# EAGLE design SparkFun_FreeSoC2_load (EAGLE 7.7.0)
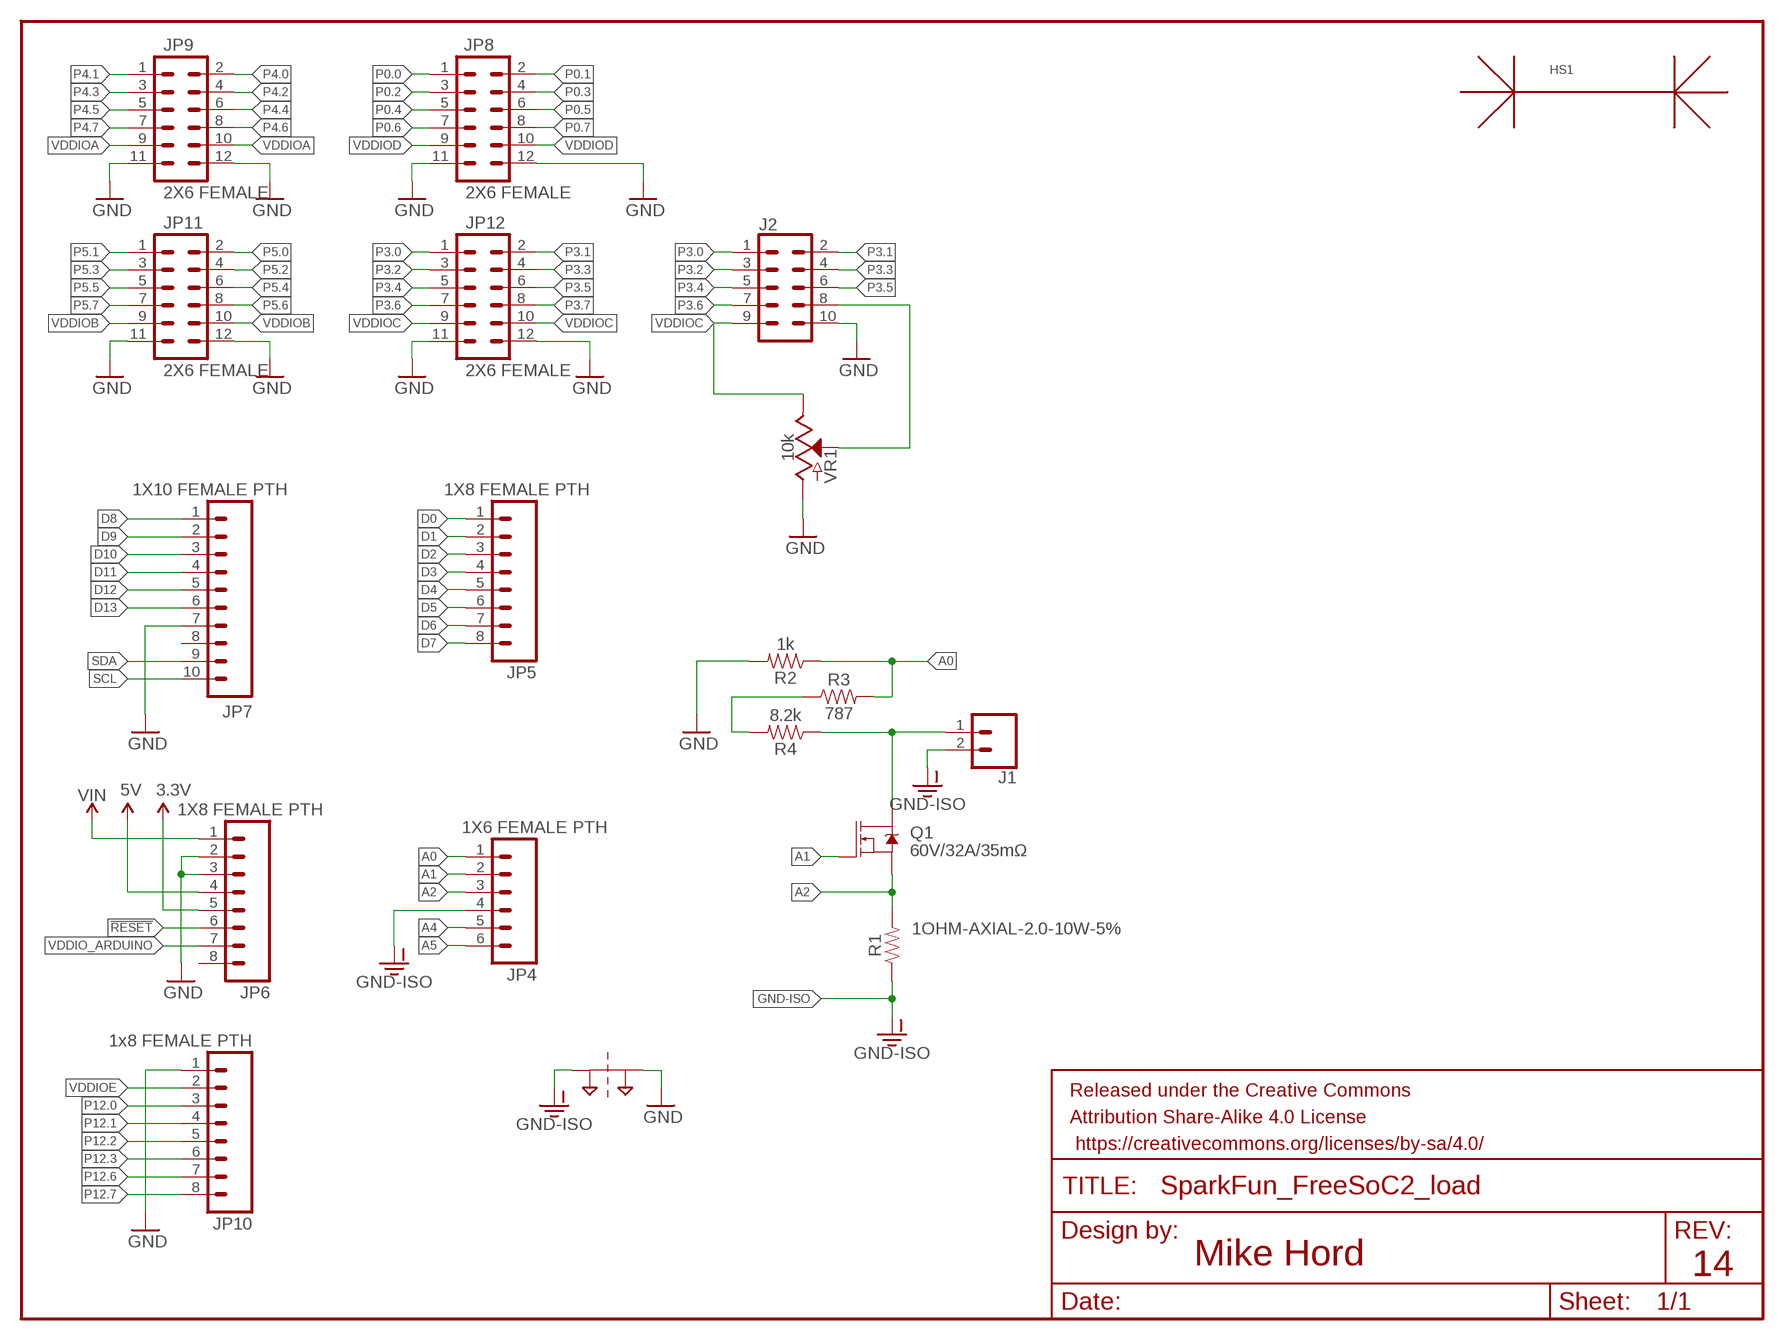
[diagram p0: schematic, sheet 1]

## Parts
FRAME3  FRAME-LETTERNO_PACKAGE  [DUMMY]
HS1  HEATSINKPRT-9576  [HEATSINK_PRT-9576]
J1  CONN_023.5MM  [SCREWTERMINAL-3.5MM-2]
J2  CONN_05X2SHD  [2X5-SHROUDED]
JP4  1X6 FEMALE PTH  M06SIP_LOCK  [1X06-SIP_LOCK]
JP5  1X8 FEMALE PTH  M08LOCK  [1X08_LOCK]
JP6  1X8 FEMALE PTH  M08LOCK  [1X08_LOCK]
JP7  1X10 FEMALE PTH  M10LOCK  [1X10_LOCK]
JP8  2X6 FEMALE  M06X2PTH_FEMALE  [2X6]
JP9  2X6 FEMALE  M06X2PTH_FEMALE  [2X6]
JP10  1x8 FEMALE PTH  M08LOCK  [1X08_LOCK]
JP11  2X6 FEMALE  M06X2PTH_FEMALE  [2X6]
JP12  2X6 FEMALE  M06X2PTH_FEMALE  [2X6]
Q1  60V/32A/35mΩ  MOSFET-NCH-FQP30N06L  [TO220V]
R1  1OHM-AXIAL-2.0-10W-5%  [AXIAL-2.0]
R2  1k  1KOHM-0603-1/10W-1%  [0603]
R3  787  787OHM-0603-1/10W-1%  [0603]
R4  8.2k  8.2KOHM-0603-1/10W-5%  [0603]
SUPPLY2  2PT_GND_TIE  [2PT_GND_TIE]
VR1  10k  POTENTIOMETER-PTH-9MM-1/20W-20%  [POT-PTH-ALPS]

## Nets
3.3V: JP6.5
5V: JP6.4
!RESET: JP6.6
A0: JP4.1 R2.1 R3.2
A1: JP4.2 Q1.1(G)
A2: JP4.3 Q1.3(S) R1.P$2
A4: JP4.5
A5: JP4.6
D0: JP5.1
D1: JP5.2
D2: JP5.3
D3: JP5.4
D4: JP5.5
D5: JP5.6
D6: JP5.7
D7: JP5.8
D8: JP7.1
D9: JP7.2
D10: JP7.3
D11: JP7.4
D12: JP7.5
D13: JP7.6
GND: J2.10 JP6.2 JP6.3 JP7.7 JP8.11 JP8.12 JP9.11 JP9.12 JP10.1 JP11.11 JP11.12 JP12.11 JP12.12 R2.2 SUPPLY2.P$1 VR1.P$3(A)
GND-ISO: J1.2 JP4.4 R1.P$1 SUPPLY2.P$2
N$3: J1.1 Q1.2(D) R4.1
N$4: R3.1 R4.2
N$15: J2.8 VR1.P$2(S)
P0.0: JP8.1
P0.1: JP8.2
P0.2: JP8.3
P0.3: JP8.4
P0.4: JP8.5
P0.5: JP8.6
P0.6: JP8.7
P0.7: JP8.8
P3.0: J2.1 JP12.1
P3.1: J2.2 JP12.2
P3.2: J2.3 JP12.3
P3.3: J2.4 JP12.4
P3.4: J2.5 JP12.5
P3.5: J2.6 JP12.6
P3.6: J2.7 JP12.7
P3.7: JP12.8
P4.0: JP9.2
P4.1: JP9.1
P4.2: JP9.4
P4.3: JP9.3
P4.4: JP9.6
P4.5: JP9.5
P4.6: JP9.8
P4.7: JP9.7
P5.0: JP11.2
P5.1: JP11.1
P5.2: JP11.4
P5.3: JP11.3
P5.4: JP11.6
P5.5: JP11.5
P5.6: JP11.8
P5.7: JP11.7
P12.0: JP10.3
P12.1: JP10.4
P12.2: JP10.5
P12.3: JP10.6
P12.6: JP10.7
P12.7: JP10.8
SCL: JP7.10
SDA: JP7.9
VDDIO_ARDUINO [ARDUINO_VCC]: JP6.7
VDDIOA: JP9.9 JP9.10
VDDIOB: JP11.9 JP11.10
VDDIOC: J2.9 JP12.9 JP12.10 VR1.P$1(E)
VDDIOD: JP8.9 JP8.10
VDDIOE: JP10.2
VIN: JP6.1
Unconnected: JP6.8 JP7.8

## Notes on the sheet
- Mike Hord
- 14

## Library data of the parts
FRAME3 = SparkFun-Aesthetics:FRAME-LETTER: Schematic Frame Standard 8.5x11 US Letter frame; DESIGNER: Nobody; VERSION: v01
HS1 = SparkFun-Electromechanical:HEATSINK; PROD_ID: COMP-9537
J1 = SparkFun-Connectors:CONN_02: Multi connection point. Often used as Generic Header-pin footprint for 0.1 inch spaced/style header connections On any of the 0.1 inch spaced packages, you can populate with these: Break Away Headers - Straight <https://www.sparkfun.com/products/116> (PRT-00116) Break Away Male Headers - Right Angle <https://www.sparkfun.com/products/553> (PRT-00553) Female Headers <https://www.sparkfun.com/products/115> (PRT-00115) Break Away Headers - Machine Pin <https://www.sparkfun.com/products/117> (PRT-00117) Break Away Female Headers - Swiss Machine Pin <https://www.sparkfun.com/products/743> (PRT-00743) For SCREWTERMINALS and SPRING TERMINALS visit here: Screw Terimnals on SparkFun.com <https://www.sparkfun.com/search/results?term=Screw+Terminals> (5mm/3.5mm/2.54mm spacing) This device is also useful as a general connection point to wire up your design to another part of your project. Our various solder wires solder well into these plated through hole pads. Hook-Up Wire - Assortment (Stranded, 22 AWG) <https://www.sparkfun.com/products/11375> (PRT-11375) Hook-Up Wire - Assortment (Solid Core, 22 AWG) <https://www.sparkfun.com/products/11367> (PRT-11367) View the entire wire category on our website here <https://www.sparkfun.com/categories/141> Special notes: Molex polarized connector foot print use with: PRT-08233 with associated crimp pins and housings. 2.54_SCREWTERM for use with PRT-10571. 3.5mm Screw Terminal footprints for PRT-08084 5mm Screw Terminal footprints for use with PRT-08432; PROD_ID: CONN-08399
J2 = SparkFun-Connectors:CONN_05X2: Multi connection point. Often used as Generic Header-pin footprint for 0.1 inch spaced/style header connections For AVR SPI programming port, see special device with nice symbol: "AVR_SPI_PROG_5x2.dev" You can populate with any combo of single row headers, but if you'd like an exact match, check these: 2x5 AVR ICSP Male Header <https://www.sparkfun.com/products/778> (PRT-00778) 2x5 Pin Shrouded Header <https://www.sparkfun.com/products/8506> (PRT-08506) On any of the 0.1 inch spaced packages, you can populate with these: Break Away Headers - Straight <https://www.sparkfun.com/products/116> (PRT-00116) Break Away Male Headers - Right Angle <https://www.sparkfun.com/products/553> (PRT-00553) Female Headers <https://www.sparkfun.com/products/115> (PRT-00115) Break Away Headers - Machine Pin <https://www.sparkfun.com/products/117> (PRT-00117) Break Away Female Headers - Swiss Machine Pin <https://www.sparkfun.com/products/743> (PRT-00743) Special note: the shrouded connector mates well with our 5x2 ribbon cables: 2x5 Pin IDC Ribbon Cable <https://www.sparkfun.com/products/8535> (PRT-08535); PROD_ID: CONN-08671; SF_ID: PRT-08506
JP4 = SparkFun-Connectors:M06: Header 6 Standard 6-pin 0.1" header. Use with straight break away headers (SKU : PRT-00116), right angle break away headers (PRT-00553), swiss pins (PRT-00743), machine pins (PRT-00117), and female headers (PRT-00115). Molex polarized connector foot print use with SKU : PRT-08094 with associated crimp pins and housings. NOTES ON THE VARIANTS LOCK and LOCK_LONGPADS... This footprint was designed to help hold the alignment of a through-hole component (i.e. 6-pin header) while soldering it into place. You may notice that each hole has been shifted either up or down by 0.005 of an inch from it's more standard position (which is a perfectly straight line). This slight alteration caused the pins (the squares in the middle) to touch the edges of the holes. Because they are alternating, it causes a "brace" to hold the component in place. 0.005 has proven to be the perfect amount of "off-center" position when using our standard breakaway headers. Although looks a little odd when you look at the bare footprint, once you have a header in there, the alteration is very hard to notice. Also,if you push a header all the way into place, it is covered up entirely on the bottom side. This idea of altering the position of holes to aid alignment will be further integrated into the Sparkfun Library for other footprints. It can help hold any component with 3 or more connection pins.; PROD_ID: CONN-08437
JP5 JP6 JP10 = SparkFun-Connectors:M08: Header 8 Standard 8-pin 0.1" header. Use with straight break away headers (SKU : PRT-00116), right angle break away headers (PRT-00553), swiss pins (PRT-00743), machine pins (PRT-00117), and female headers (PRT-00115).; PROD_ID: CONN-08438
JP7 = SparkFun-Connectors:M10: Header 10 Standard 10-pin 0.1" header. Use with straight break away headers (SKU : PRT-00116), right angle break away headers (PRT-00553), swiss pins (PRT-00743), machine pins (PRT-00117), and female headers (PRT-00115).; PROD_ID: CONN-11563
JP8 JP9 JP11 JP12 = SparkFun-Connectors:M06X2; PROD_ID: CONN-12423
Q1 = SparkFun-DiscreteSemi:MOSFET-NCH: N-channel MOSFETs Voltage controlled devices that allow control of high current outputs. SparkFun Products: SparkFun OpenScale <https://www.sparkfun.com/products/13261> SparkFun Digital Sandbox <https://www.sparkfun.com/products/12651> SparkFun Monster Moto Shield <https://www.sparkfun.com/products/10182> SparkFun MOSFET Power Controller <https://www.sparkfun.com/products/11214>; PROD_ID: TRANS-10060
R1 = SparkFun-Resistors:1OHM: 1Ω resistor A resistor is a passive two-terminal electrical component that implements electrical resistance as a circuit element. Resistors act to reduce current flow, and, at the same time, act to lower voltage levels within circuits. - Wikipedia
R2 = SparkFun-Resistors:1KOHM: 1kΩ resistor A resistor is a passive two-terminal electrical component that implements electrical resistance as a circuit element. Resistors act to reduce current flow, and, at the same time, act to lower voltage levels within circuits. - Wikipedia; PROD_ID: RES-07856
R3 = SparkFun-Resistors:787OHM: 787Ω resistor A resistor is a passive two-terminal electrical component that implements electrical resistance as a circuit element. Resistors act to reduce current flow, and, at the same time, act to lower voltage levels within circuits. - Wikipedia; PROD_ID: RES-11228
R4 = SparkFun-Resistors:8.2KOHM: 8.2kΩ resistor A resistor is a passive two-terminal electrical component that implements electrical resistance as a circuit element. Resistors act to reduce current flow, and, at the same time, act to lower voltage levels within circuits. - Wikipedia; PROD_ID: RES-10646
SUPPLY2 = SparkFun-PowerSymbols:2PT_GND_TIE: Dual Ground Supply Power supply symbol for connecting two grounds. SparkFun Products: SparkFun AutoDriver - Stepper Motor Driver <https://www.sparkfun.com/products/11611>
VR1 = SparkFun-Resistors:POTENTIOMETER: Potentiometer (Pot) Three-terminal potentiometers, with an adjustable wiper and two adjustable resistors. A pot can be used to create a configurable voltage divider, or as a variable resistor. Variants ALPS_POT and ALPS_POT_KIT - PTH, breadboard compatible, 9mm square pots Rotary Potentiometer - Linear (10k ohm) <https://www.sparkfun.com/products/9288> (COM-09288) The KIT variant exposes copper on only one side of the PTH pad, so the part can only be assembled on one side of the PCB. Useful for beginner soldering kits.; PROD_ID: RES-09177; SF_SKU: COM-09288

## Net classes
0 signal: width 0.178 mm, drill 0.381 mm, clearance 0.178 mm
1 AVCC: width 0.508 mm, drill 0.508 mm, clearance 0.178 mm
2 ARDUINO_VCC: width 0.508 mm, drill 0.381 mm

## Board
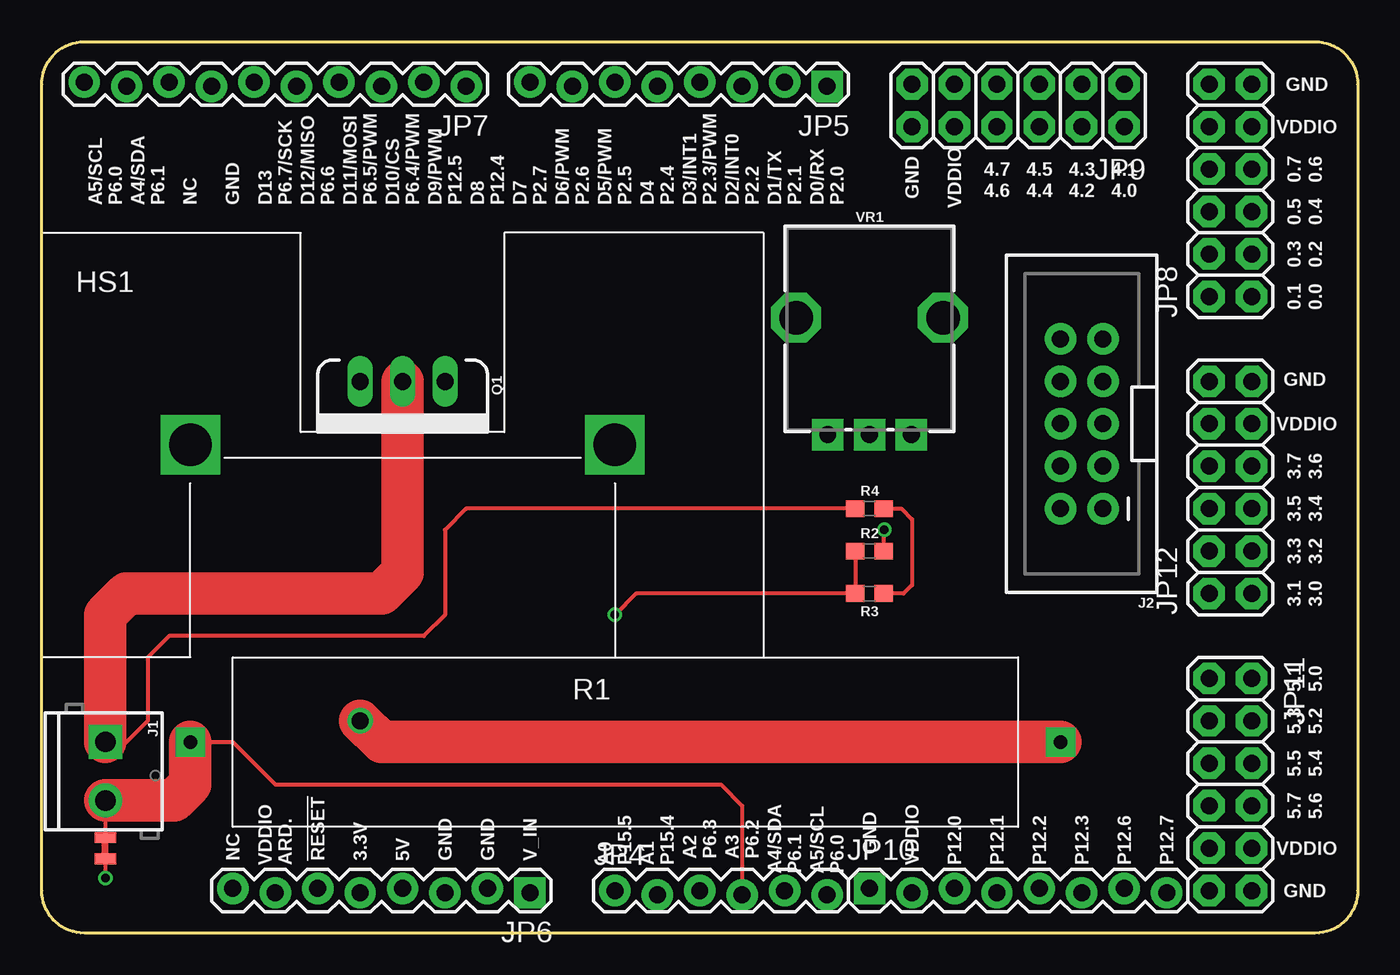
[diagram p1: board, top side]
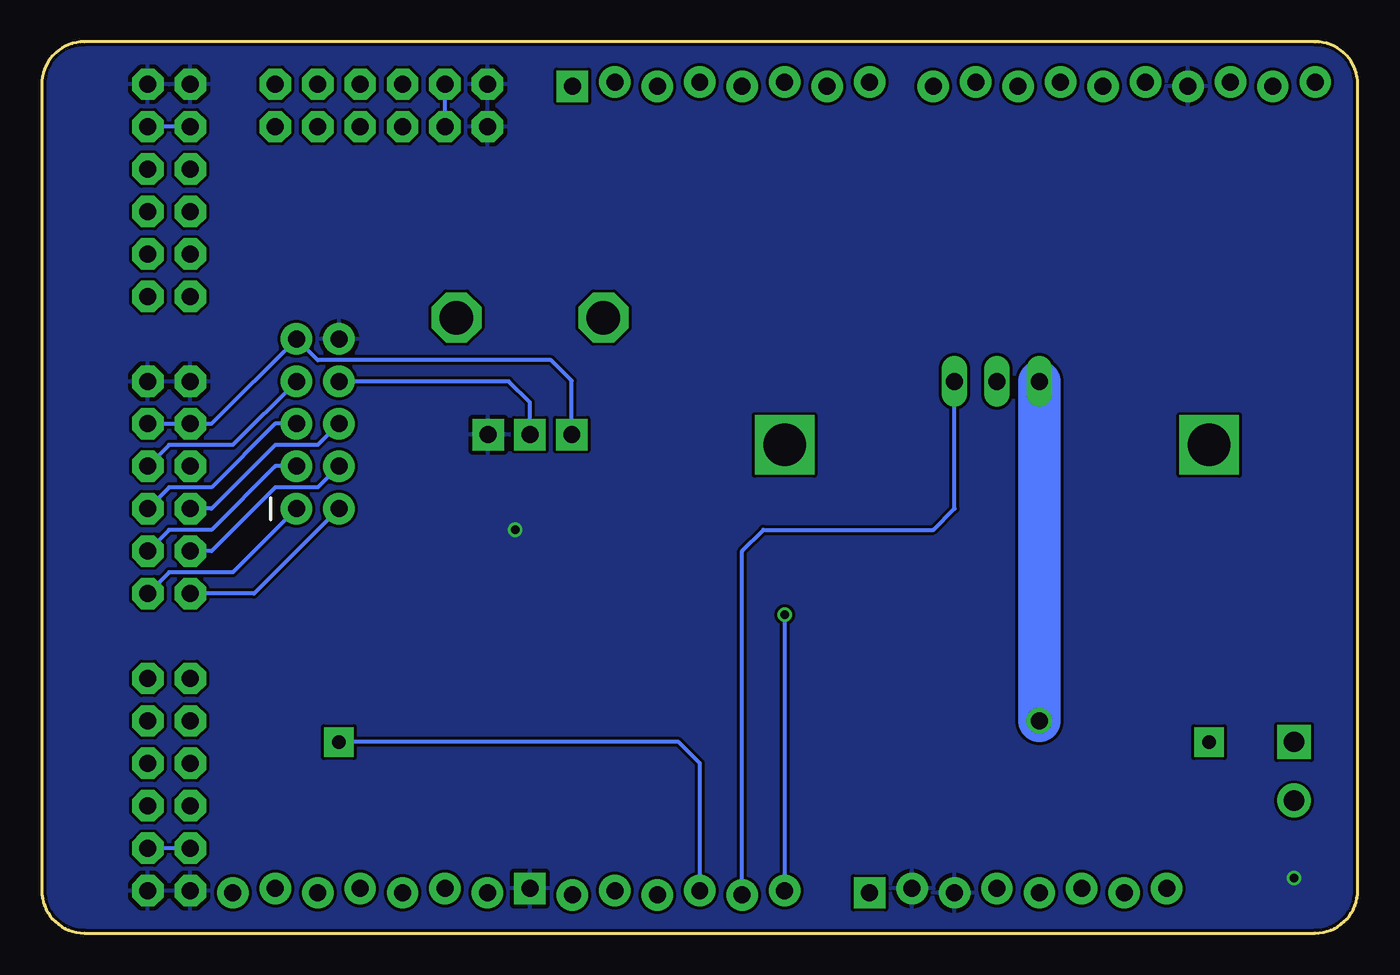
[diagram p2: board, bottom side, seen from below]

Size 78.74 x 53.34 mm. Coordinates in mm from the lower left corner, seen from the top.
Outline: 76.2,0 2.54,0 arc-90 0,2.54 0,50.8 arc-90 2.54,53.34 76.2,53.34 arc-90 78.74,50.8 78.74,2.54 arc-90 76.2,0
Copper layers (1*2*15*16): Top 0.035mm / dielectric 1.5mm / Route2 0.035mm / dielectric 0.15mm / Route15 0.035mm / dielectric 0.2mm / Bottom 0.035mm
Design rules "SparkFun-2-layer-TIGHT *": minimum track width 7mil, minimum drill 15mil, track to track 7mil, track to pad 7mil, pad to pad 7mil, via to via 7mil, smd to smd 7mil, copper to edge 7mil, drill to drill 7mil, minimum pad ring 7mil, minimum via ring 7mil, stop-mask expansion 4mil, vias tented up to drill 20mil, thermal gap 10mil

### Footprints (pad centres in the part's own frame; a part is rotated, then mirrored left to right if it is on the bottom)
HEATSINK_PRT-9576 = drill 2.54 square: P$1 -12.7,0; P$2 12.7,0
SCREWTERMINAL-3.5MM-2 = drill 1.2 pad 2.032 square: 1 0,0 | drill 1.2 pad 2.032: 2 3.5,0
2X5-SHROUDED = drill 1.016 pad 1.88: 1 -1.27,5.08; 2 1.27,5.08; 3 -1.27,2.54; 4 1.27,2.54; 5 -1.27,0; 6 1.27,0; 7 -1.27,-2.54; 8 1.27,-2.54; 9 -1.27,-5.08; 10 1.27,-5.08
1X06-SIP_LOCK = drill 1.016 pad 1.88: 1 0,0; 2 2.54,-0.254; 3 5.08,0; 4 7.62,-0.254; 5 10.16,0; 6 12.7,-0.254
1X08_LOCK = drill 1.016 pad 1.88 square: 1 0,0.127 | drill 1.016 pad 1.88: 2 2.54,-0.127; 3 5.08,0.127; 4 7.62,-0.127; 5 10.16,0.127; 6 12.7,-0.127; 7 15.24,0.127; 8 17.78,-0.127
1X10_LOCK = drill 1.016 pad 1.88: 1 0,0.127; 2 2.54,-0.127; 3 5.08,0.127; 4 7.62,-0.127; 5 10.16,0.127; 6 12.7,-0.127; 7 15.24,0.127; 8 17.78,-0.127; 9 20.32,0.127; 10 22.86,-0.127
2X6 = drill 1.016 pad 1.88 octagon: 1 0,0; 2 0,2.54; 3 2.54,0; 4 2.54,2.54; 5 5.08,0; 6 5.08,2.54; 7 7.62,0; 8 7.62,2.54; 9 10.16,0; 10 10.16,2.54; 11 12.7,0; 12 12.7,2.54
TO220V = drill 1.016 long: 1 -2.54,0; 2 0,0; 3 2.54,0
AXIAL-2.0 = drill 0.8 pad 1.778 square: P$1 -25.4,0; P$2 26.67,0
0603 = smd 1.1 x 1: 1 -0.85,0; 2 0.85,0
2PT_GND_TIE = smd 1.27 x 0.635: P$1 0,0.635; P$2 0,-0.635
POT-PTH-ALPS = drill 1 pad 1.88 square: P$1 7,-2.5; P$2 7,0; P$3 7,2.5 | drill 2 octagon: P$4 0,-4.4; P$5 0,4.4

### Placement (x,y rotation side)
FRAME3  -15.24,-17.78 0 top  (outside the outline)
HS1  21.59,29.21 0 top
J1  3.81,11.43 270 top
J2  62.23,30.48 180 top
JP4  34.29,2.54 0 top
JP5  46.99,50.8 180 top
JP6  29.21,2.54 180 top
JP7  25.4,50.8 180 top
JP8  72.39,38.1 90 top
JP9  64.77,50.8 180 top
JP10  49.53,2.54 0 top
JP11  69.85,15.24 270 top
JP12  72.39,20.32 90 top
Q1  21.59,33.02 180 top
R1  34.29,11.43 0 top
R2  49.53,22.86 0 top
R3  49.53,20.32 180 top
R4  49.53,25.4 0 top
SUPPLY2  3.81,5.08 180 top
U$2  [CREATIVE_COMMONS@1]  35.56,-27.94 0 top  (outside the outline)
VR1  49.53,36.83 270 top

### Tracks (layer width: path | path; a pad name or v marks a point on that pad's centre or on a via)
A0  (via drill 0.51)
  Top 0.254: R2.1 R3.2 35.56,20.32 v34.29,19.05
  Bottom 0.254: v34.29,19.05 JP4.1
A1
  Bottom 0.254: JP4.2 36.83,22.86 35.56,24.13 25.4,24.13 24.13,25.4 Q1.1
A2  (via drill 1.02)
  Top 2.54: R1.P$2 20.32,11.43 v19.05,12.7
  Bottom 0.254: JP4.3 39.37,10.16 40.64,11.43 R1.P$2
  Bottom 2.54: v19.05,12.7 Q1.3
GND  (via drill 0.51)
  Top 0.254: R2.2 50.38,24.09 v50.42,24.13 | SUPPLY2.P$1 v3.81,3.3
  pour Bottom: 0,53.34 78.74,53.34 78.74,0 0,0
GND-ISO
  Top 0.254: J1.2 SUPPLY2.P$2 | JP4.4 41.91,7.62 40.64,8.89 13.97,8.89 11.43,11.43 10.16,11.43 8.89,10.16 8.89,8.89
  Top 2.54: J1.2 7.93,7.93 8.89,8.89 R1.P$1
N$3
  Top 0.254: R4.1 25.4,25.4 24.13,24.13 24.13,19.05 22.86,17.78 7.62,17.78 6.35,16.51 6.35,12.7 5.08,11.43 J1.1
  Top 2.54: J1.1 3.81,19.05 5.08,20.32 20.32,20.32 21.59,21.59 Q1.2
N$4
  Top 0.254: R4.2 51.44,25.4 52.07,24.77 52.07,20.83 51.56,20.32 R3.1
N$15
  Bottom 0.254: VR1.P$2 49.53,31.75 50.8,33.02 J2.8
P3.0
  Bottom 0.254: J2.1 67.31,21.59 71.12,21.59 JP12.1
P3.1
  Bottom 0.254: J2.2 66.04,20.32 JP12.2
P3.2
  Bottom 0.254: J2.3 64.77,27.94 68.58,24.13 71.12,24.13 JP12.3
P3.3
  Bottom 0.254: J2.4 62.23,26.67 64.77,26.67 68.58,22.86 JP12.4
P3.4
  Bottom 0.254: J2.5 64.77,30.48 68.58,26.67 71.12,26.67 JP12.5
P3.5
  Bottom 0.254: J2.6 62.23,29.21 64.77,29.21 68.58,25.4 JP12.6
P3.6
  Bottom 0.254: J2.7 67.31,29.21 71.12,29.21 JP12.7
VDDIOA
  Bottom 0.254: JP9.10 JP9.9
VDDIOB
  Bottom 0.254: JP11.9 JP11.10
VDDIOC
  Bottom 0.254: JP12.9 JP12.10 68.58,30.48 J2.9 62.23,34.29 48.26,34.29 47.03,33.06 VR1.P$1
VDDIOD
  Bottom 0.254: JP8.10 JP8.9

### Text on the board
tPlace: GND | VDDIO | 4.7 | 4.5 | 4.3 | 4.1 | 0.7 | 0.6 | GND | VDDIO | A5/SCL / P6.0 | A4/SDA / P6.1 | NC | GND | D13 / P6.7/SCK | D12/MISO / P6.6 | D11/MOSI / P6.5/PWM | D10/CS / P6.4/PWM | D9/PWM / P12.5 | D8 / P12.4 | D7 / P2.7 | D6/PWM / P2.6 | D5/PWM / P2.5 | D4 / P2.4 | D3/INT1 / P2.3/PWM | D2/INT0 / P2.2 | D1/TX / P2.1 | D0/RX / P2.0 | 4.6 | 4.4 | 4.2 | 4.0 | 0.5 | 0.4 | 0.3 | 0.2 | 0.1 | 0.0 | GND | VDDIO | 3.7 | 3.6 | 3.5 | 3.4 | 3.3 | 3.2 | 3.1 | 3.0 | 5.1 | 5.0 | 5.3 | 5.2 | 5.5 | 5.4 | 5.7 | 5.6 | GND | VDDIO | NC | VDDIO / ARD. | !RESET | 3.3V | 5V | GND | GND | V_IN | A0 / P15.5 | A1 / P15.4 | A2 / P6.3 | A3 / P6.2 | A4/SDA / P6.1 | A5/SCL / P6.0 | VDDIO | P12.0 | P12.1 | P12.2 | P12.3 | P12.6 | P12.7 | GND
Measures: Measurement units given in inches
tDocu: Mike Hord